# Altium schematic sheet Audio.SchDoc: Audio
size A3; Date: 3/31/2015; Author: P.A.; CompanyName: STMicroelectronics; Organization: Microcontrollers Division; Address1: 12, Rue Jules HOROWITZ; Address2: 38019 Grenoble; Address3: FRANCE; DocumentNumber: MB1209; Revision: D-02; SheetNumber: 7; SheetTotal: 11; Project: STM32F412G-DISCO; ModifiedDate: 6/2/2016
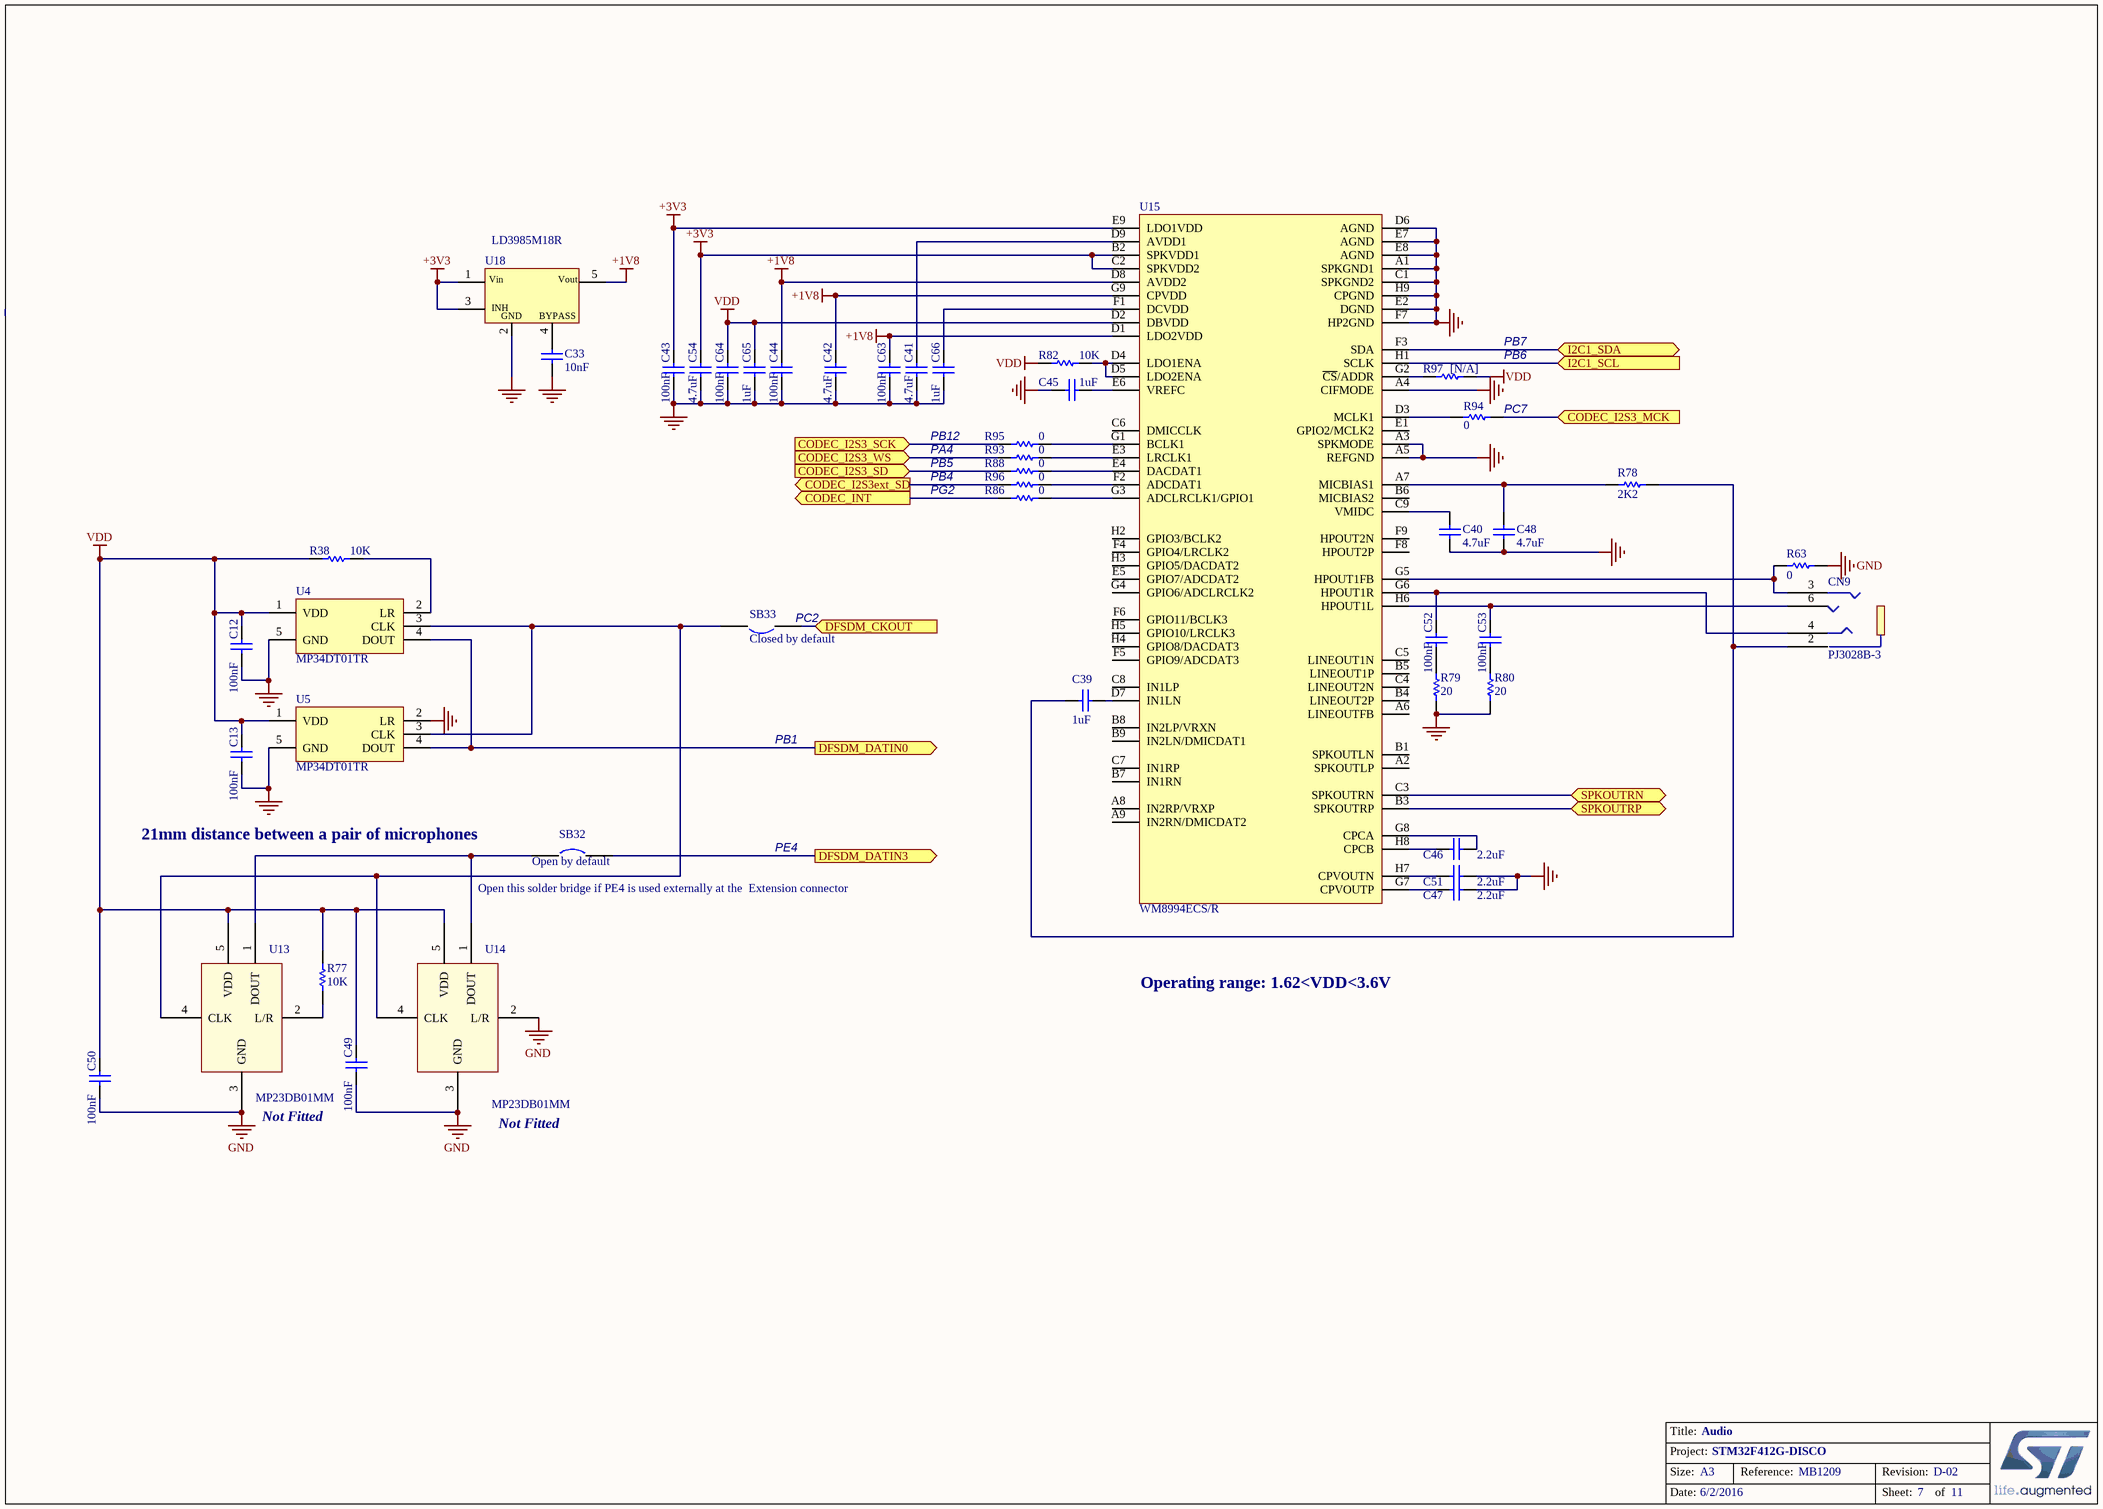
[diagram p0: Audio.SchDoc]

## Parts
C12  100nF  [0402C]
C13  100nF  [0402C]
C33  10nF  [0603C]
C39  1uF  [0603C]
C40  4.7uF  [0603C]
C41  4.7uF  [0603C]
C42  4.7uF  [0603C]
C43  100nF  [0402C]
C44  100nF  [0402C]
C45  1uF  [0603C]
C46  2.2uF  [0603C]
C47  2.2uF  [0603C]
C48  4.7uF  [0603C]
C49  100nF  [0402C]
C50  100nF  [0402C]
C51  2.2uF  [0603C]
C52  100nF  [0402C]
C53  100nF  [0402C]
C54  4.7uF  [0603C]
C63  100nF  [0402C]
C64  100nF  [0402C]
C65  1uF  [0603C]
C66  1uF  [0603C]
CN9  PJ3028B-3  [PJ3028B]
R38  10K  [0402R]
R63  0  [SB_0603]
R77  10K  [0402R]
R78  2K2  [0603R]
R79  20  [0402R]
R80  20  [0402R]
R82  10K  [0402R]
R86  0  [SB_0603]
R88  0  [SB_0603]
R93  0  [SB_0603]
R94  0  [SB_0603]
R95  0  [SB_0603]
R96  0  [SB_0603]
R97  [N/A]  [0603R]
SB32  Open by default  [SB_0603]
SB33  Closed by default  [SB_0603]
U4  MP34DT01TR  [MP34DT01TR]
U5  MP34DT01TR  [MP34DT01TR]
U13  MP23DB01MM  [RHLGA5LD]
U14  MP23DB01MM  [RHLGA5LD]
U15  WM8994ECS/R  [BGA72_0R5_4R5X4]
U18  LD3985M18R  [SOT23-5]

## Ports
CODEC_I2S3_MCK (in), CODEC_I2S3_SCK (in), CODEC_I2S3_SD (in), CODEC_I2S3_WS (in), CODEC_I2S3ext_SD (out), CODEC_INT (out), DFSDM_CKOUT (in), DFSDM_DATIN0 (out), DFSDM_DATIN3 (out), I2C1_SCL (in), I2C1_SDA (bidir), SPKOUTRN, SPKOUTRP

## Nets
+1V8: C42.1 C44.1 C63.1 U15.D1(LDO2VDD) U15.D8(AVDD2) U15.G9(CPVDD) U18.5(Vout)
+3V3: C43.1 C54.1 U15.B2(SPKVDD1) U15.C2(SPKVDD2) U15.E9(LDO1VDD) U18.1(Vin) U18.3(CE)
GND: C12.2 C13.2 C33.1 C40.1 C41.2 C42.2 C43.2 C44.2 C45.2 C47.2 C48.1 C49.2 C50.2 C51.2 C54.2 C63.2 C64.2 C65.2 C66.2 R63.2 R79.2 R80.2 U4.5(GND) U5.2(LR) U5.5(GND) U13.3(GND) U14.2(L/R) U14.3(GND) U15.A1(SPKGND1) U15.A3(SPKMODE) U15.A4(CIFMODE) U15.A5(REFGND) U15.C1(SPKGND2) U15.D6(AGND) U15.E2(DGND) U15.E7(AGND) U15.E8(AGND) U15.F7(HP2GND) U15.H9(CPGND) U18.2(GND)
VDD: C12.1 C13.1 C49.1 C50.1 C64.1 C65.1 R38.2 R77.1 R82.2 R97.1 U4.1(VDD) U5.1(VDD) U13.5(VDD) U14.5(VDD) U15.D2(DBVDD)
CODEC_I2S3_MCK: R94.1 ; port CODEC_I2S3_MCK
CODEC_I2S3_SCK: R95.2 ; port CODEC_I2S3_SCK
CODEC_I2S3_SD: R88.2 ; port CODEC_I2S3_SD
CODEC_I2S3_WS: R93.2 ; port CODEC_I2S3_WS
CODEC_I2S3ext_SD: R96.2 ; port CODEC_I2S3ext_SD
CODEC_INT: R86.2 ; port CODEC_INT
DFSDM_CKOUT: SB33.1 ; port DFSDM_CKOUT
DFSDM_DATIN0: U4.4(DOUT) U5.4(DOUT) ; port DFSDM_DATIN0
DFSDM_DATIN3: SB32.2 ; port DFSDM_DATIN3
I2C1_SCL: U15.H1(SCLK) ; port I2C1_SCL
I2C1_SDA: U15.F3(SDA) ; port I2C1_SDA
SPKOUTRN: U15.C3(SPKOUTRN) ; port SPKOUTRN
SPKOUTRP: U15.B3(SPKOUTRP) ; port SPKOUTRP
NetC33_2: C33.2 U18.4(BYPASS)
NetC39_1: C39.1 U15.D7(IN1LN)
NetC39_2: C39.2 CN9.2 R78.2
NetC40_2: C40.2 U15.C9(VMIDC)
NetC41_1: C41.1 U15.D9(AVDD1)
NetC45_1: C45.1 U15.E6(VREFC)
NetC46_1: C46.1 U15.H8(CPCB)
NetC46_2: C46.2 U15.G8(CPCA)
NetC47_1: C47.1 U15.G7(CPVOUTP)
NetC48_2: C48.2 R78.1 U15.A7(MICBIAS1)
NetC51_1: C51.1 U15.H7(CPVOUTN)
NetC52_1: C52.1 CN9.4 U15.G6(HPOUT1R)
NetC52_2: C52.2 R79.1
NetC53_1: C53.1 CN9.6 U15.H6(HPOUT1L)
NetC53_2: C53.2 R80.1
NetC66_1: C66.1 U15.F1(DCVDD)
NetCN9_3: CN9.3 R63.1 U15.G5(HPOUT1FB)
NetR38_1: R38.1 U4.2(LR)
NetR77_2: R77.2 U13.2(L/R)
NetR82_1: R82.1 U15.D4(LDO1ENA) U15.D5(LDO2ENA)
NetR86_1: R86.1 U15.G3(ADCLRCLK1/GPIO1)
NetR88_1: R88.1 U15.E4(DACDAT1)
NetR93_1: R93.1 U15.E3(LRCLK1)
NetR94_2: R94.2 U15.D3(MCLK1)
NetR95_1: R95.1 U15.G1(BCLK1)
NetR96_1: R96.1 U15.F2(ADCDAT1)
NetR97_2: R97.2 U15.G2(~{CS}/ADDR)
NetSB32_1: SB32.1 U13.1(DOUT) U14.1(DOUT)
NetSB33_2: SB33.2 U4.3(CLK) U5.3(CLK) U13.4(CLK) U14.4(CLK)

Not connected (* = marked no-connect by the designer): U15 A2(SPKOUTLP) A6(LINEOUTFB) A8(IN2RP/VRXP) A9(IN2RN/DMICDAT2) B1(SPKOUTLN) B4(LINEOUT2P) B5(LINEOUT1P) B6(MICBIAS2) B7(IN1RN) B8(IN2LP/VRXN) B9(IN2LN/DMICDAT1) C4(LINEOUT2N) C5(LINEOUT1N) C6(DMICCLK) C7(IN1RP) C8(IN1LP) E1(GPIO2/MCLK2) E5(GPIO7/ADCDAT2) F4(GPIO4/LRCLK2) F5(GPIO9/ADCDAT3) F6(GPIO11/BCLK3) F8(HPOUT2P) F9(HPOUT2N) G4(GPIO6/ADCLRCLK2) H2(GPIO3/BCLK2) H3(GPIO5/DACDAT2) H4(GPIO8/DACDAT3) H5(GPIO10/LRCLK3)

## Notes on the sheet
- PB7
- PB6
- PB12
- PA4
- (near R94) PC7
- PB5
- PB4
- PG2
- (near SB33) PC2
- PB1
- 21mm distance between a pair of microphones
- PE4
- (near SB32) Open this solder bridge if PE4 is used externally at the  Extension connector
- Operating range: 1.62<VDD<3.6V
- Not Fitted
- (near U14) Not Fitted
- Title:
- Project:
- Size:
- Date:
- A3
- Reference:
- Sheet:
- Revision:
- of
- (in symbol LD3985M33R) INH

## Library data of the parts
C12 C13 C40-C44 C48-C50 C52-C54 C63 C64 = Cap: Capacitor; Value: 10nF; Ordered by: Subcon; ECCN_US/EU: NA; Published: 8-Jun-2000; Revision: July-2002: Re-released for DXP Platform.; Publisher: Altium Limited
C33 = CAP SMD 0603  X7R 10000PF 50V 10%: 0603  X7R 10NF; Order code RS: 2040779; Rated voltage: 50V; Tolerance: 10%; Ordered by: Subcon; ECCN_US/EU: NA; Order code Farnell: 7569548RL; Value: 10NF; Power: *; Technology: X7R; Temperature Factor: *; Temperature Min: -55°C; Temperature Max: +125°C; STS Code: *
C39 C45-C47 C51 C65 C66 = CAP: Capacitor; Value: 100nF; Ordered by: Subcon; ECCN_US/EU: NA; Published: 8-Jun-2000; Revision: July-2002: Re-released for DXP Platform.; Publisher: Altium Limited
CN9 = PJ3028B-3: Manuf_1: QIAOD; Ordered by: Subcon; Silkscreen: AUDIO_JACK; ECCN_US/EU: NA; Manuf_Part_1: PJ3028B-3
R38 R63 R77-R80 R82 R86 R88 R93-R96 = Res1: Resistor; Value: 1K; Ordered by: Subcon; ECCN_US/EU: NA; Published: 8-Jun-2000; Revision: July-2002: Re-released for DXP Platform.; Publisher: Altium Limited
R97 = Res1: Resistor; Value: 1K; Ordered by: Subcon; Fitted: NO; ECCN_US/EU: NA; Published: 8-Jun-2000; Revision: July-2002: Re-released for DXP Platform.; Publisher: Altium Limited
SB32 = Circuit Breaker: Ordered by: Subcon; Comments: Solder bridge; Fitted: NO; ECCN_US/EU: NA; Published: 24-Mar-1999; Revision: July-2002: Re-released for DXP Platform.; Publisher: Altium Limited
SB33 = Circuit Breaker: Ordered by: Subcon; Comments: Solder bridge; ECCN_US/EU: NA; Published: 24-Mar-1999; Revision: July-2002: Re-released for DXP Platform.; Publisher: Altium Limited
U4 U5 = MP34DT01TR: MEMS audio sensor; Ordered by: ST; ECCN_US/EU: EAR99/NEC; Ref St: 9188008; Revision: 17-Jul-2002: Re-released for DXP Platform.; Publisher: Altium Limited; Manuf_1: ST; Manuf_Part_1: MP34DT01TR
U13 = MP23DB01MM: MEMS micro; Ordered by: ST; ECCN_US/EU: EAR99/NEC; Ref St: 9188010; Fitted: NO; Publisher: ST; Manuf_1: ST; Manuf_Part_1: MP23DB01MM
U14 = MP23DB01MM: MEMS micro; Manuf_1: ST; ECCN_US/EU: EAR99/NEC; Ref St: 9188010; Fitted: NO; Publisher: ST; Manuf_Part_1: MP23DB01MM; Ordered by: ST
U15 = WM8994ECS/R: Manuf_1: Cirrus/Wolfson; Ordered by: Subcon; ECCN_US/EU: EAR99/NEC; Manuf_Part_1: WM8994ECS/R
U18 = LD3985M33R: Ultra low drop-low noise BiCMOS voltage, regulators low ESR capacitors compatible; Manuf_1: ST; Manuf_Part_2: LDK120M18R; Ref St: 9176159; ECCN_US/EU: EAR99/NEC; Manuf_Part_1: LD3985M18R; Provided: ST; Distrib: ST; Order: LD3985M18R; Ordered by: ST; Manuf_2: ST